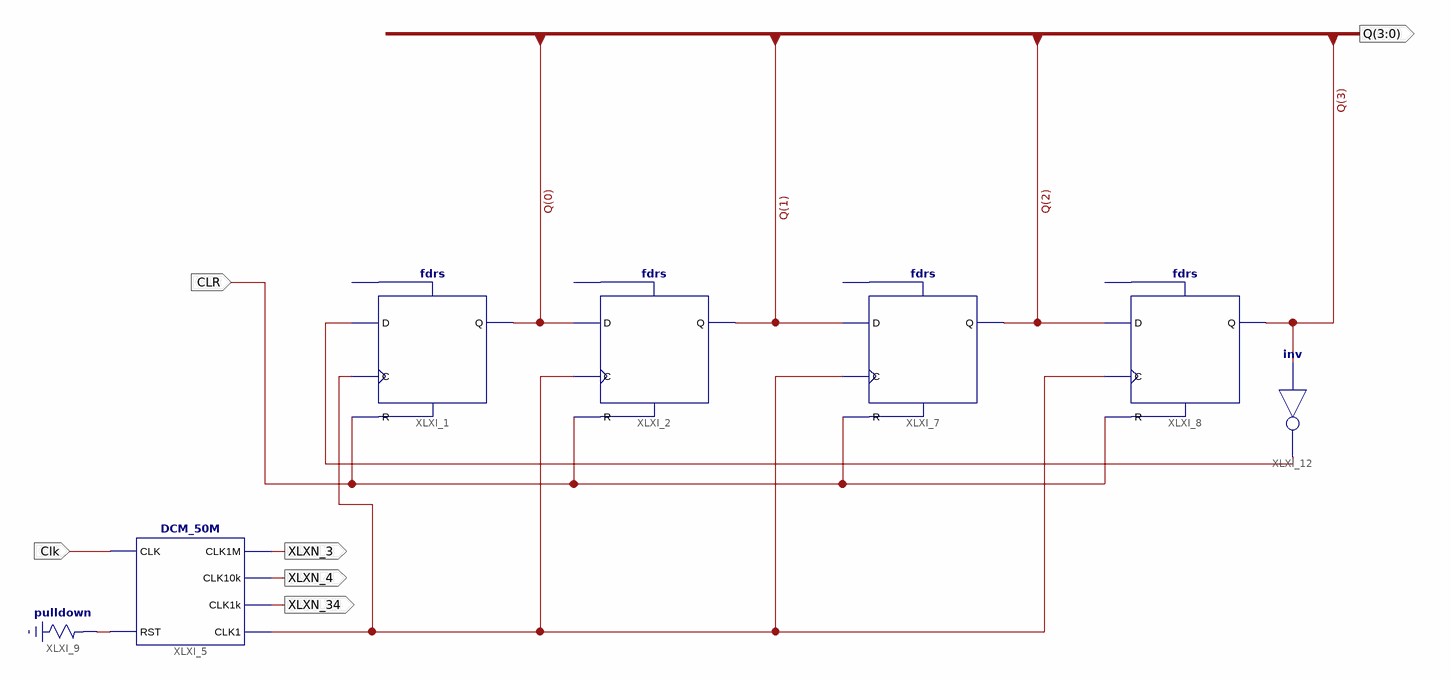
[diagram p0: schematic sheet 1]
// Xilinx ISE schematic Lab7Exp8.sch (spartan3e) as structural Verilog: 7 symbols, 6 ports
module Lab7Exp8 (
  input  Clk,
  input  CLR,
  output XLXN_3,
  output XLXN_4,
  output XLXN_34,
  output [3:0] Q
);

  wire XLXN_2, XLXN_20, XLXN_39;

  fdrs XLXI_1 (.C(XLXN_20), .D(XLXN_39), .R(CLR), .Q(Q[0]));  // open: S
  fdrs XLXI_2 (.C(XLXN_20), .D(Q[0]), .R(CLR), .Q(Q[1]));  // open: S
  fdrs XLXI_7 (.C(XLXN_20), .D(Q[1]), .R(CLR), .Q(Q[2]));  // open: S
  fdrs XLXI_8 (.C(XLXN_20), .D(Q[2]), .R(CLR), .Q(Q[3]));  // open: S
  DCM_50M XLXI_5 (.CLK(Clk), .RST(XLXN_2), .CLK1M(XLXN_3), .CLK10k(XLXN_4), .CLK1k(XLXN_34), .CLK1(XLXN_20));
  \pulldown  XLXI_9 (.O(XLXN_2));
  not XLXI_12 (XLXN_39, Q[3]);
endmodule
